# EAGLE design eiffel_mini Version2_2 (EAGLE 7.3.0)
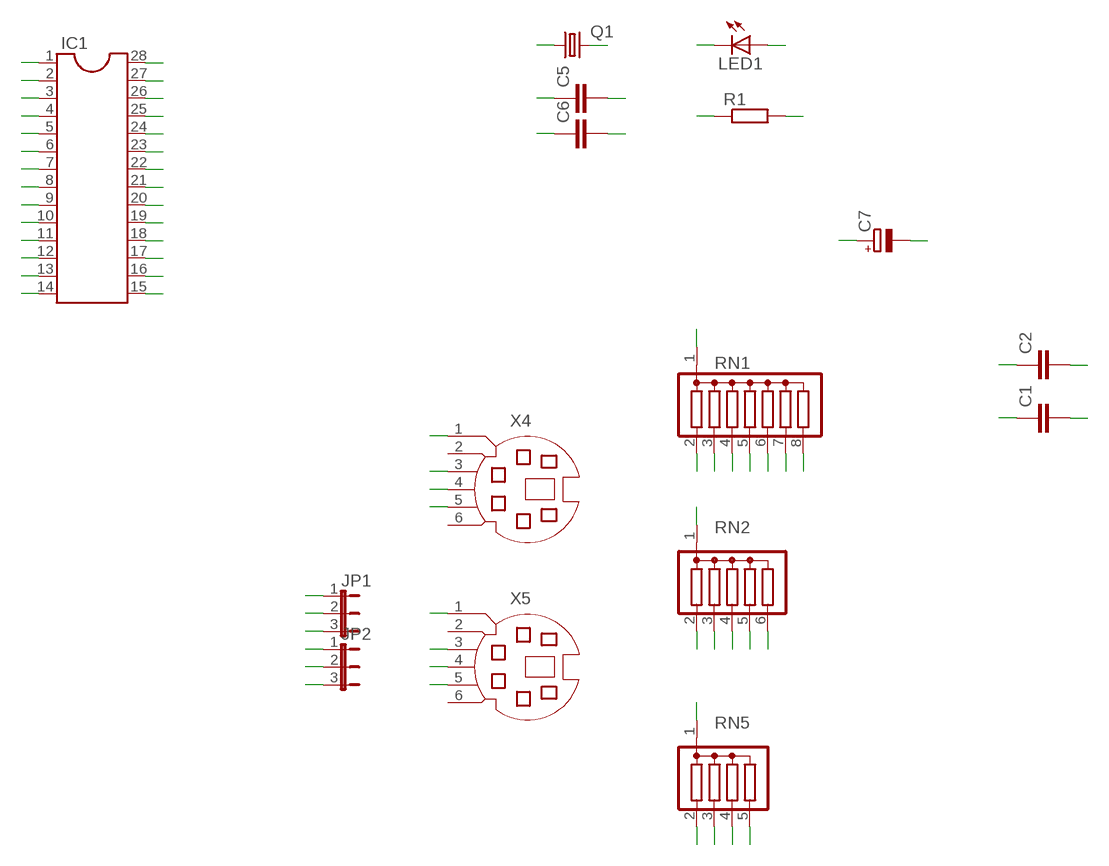
[diagram p0: schematic, sheet 1]

## Parts
C1  C-EU025-060X050  [C025-060X050]
C2  C-EU025-060X050  [C025-060X050]
C5  C-EU025-024X044  [C025-024X044]
C6  C-EU025-024X044  [C025-024X044]
C7  CPOL-EUE2,5-6E  [E2,5-6E]
IC1  DIL28-3  [DIL28-3]
JP1  JP2E  [JP2]
JP2  JP2E  [JP2]
LED1  LED3MM  [LED3MM]
Q1  CRYSTALHC49S  [HC49/S]
R1  R-EU_0204/7  [0204/7]
RN1  G07R  [SIL8]
RN2  G05R  [SIL6]
RN5  G04R  [SIL5]
X4  MD06S  [MDIN06S]
X5  MD06S  [MDIN06S]

## Nets
/MCLR: IC1.1 RN1.7
GND: C1.2 C2.2 C5.2 C6.2 C7.- IC1.8 IC1.19 JP2.2 JP2.3 LED1.K(C) X4.3 X5.3
LED: LED1.A R1.1
RA0: IC1.2 RN1.8
RA1: IC1.3 RN1.2
RA2: IC1.4 RN1.3
RA3: IC1.5 RN1.4
RA4: IC1.6 RN1.5
RA5: IC1.7 RN1.6
RB0: IC1.21 RN5.2 X5.1
RB1: IC1.22 RN5.3 X5.5
RB2: IC1.23 RN5.4 X4.1
RB3: IC1.24 RN5.5 X4.5
RB4: IC1.25
RB5: IC1.26
RB6: IC1.27
RB7: IC1.28
RC0: IC1.11 RN2.2
RC1: IC1.12 RN2.3
RC2: IC1.13 RN2.4
RC3: IC1.14 RN2.5
RC4: IC1.15 RN2.6
RC5: IC1.16
RC6: IC1.17 JP2.1
RC7: IC1.18 JP1.3
VCC: C1.1 C2.1 C7.+ IC1.20 JP1.1 JP1.2 R1.2 RN1.1 RN2.1 RN5.1 X4.4 X5.4
XI: C5.1 IC1.9 Q1.1
XO: C6.1 IC1.10 Q1.2
Unconnected: X4.2 X4.6 X5.2 X5.6

## Library data of the parts
C1 C2 C5 C6 = resistor:C-EU: CAPACITOR, European symbol
C7 = resistor:CPOL-EU: POLARIZED CAPACITOR, European symbol
IC1 = ic-package:DIL28: Dual In Line
JP1 JP2 = jumper:JP2E: JUMPER
LED1 = led:LED: LED OSRAM: - CHIPLED LG R971, LG N971, LY N971, LG Q971, LY Q971, LO R971, LY R971 LH N974, LH R974 LS Q976, LO Q976, LY Q976 LO Q996 - Hyper CHIPLED LW Q18S LB Q993, LB Q99A, LB R99A - SideLED LS A670, LO A670, LY A670, LG A670, LP A670 LB A673, LV A673, LT A673, LW A673 LH A674 LY A675 LS A676, LA A676, LO A676, LY A676, LW A676 LS A679, LY A679, LG A679 - Hyper Micro SIDELED® LS Y876, LA Y876, LO Y876, LY Y876 LT Y87S - SmartLED LW L88C, LW L88S LB L89C, LB L89S, LG L890 LS L89K, LO L89K, LY L89K LS L896, LA L896, LO L896, LY L896 - TOPLED LS T670, LO T670, LY T670, LG T670, LP T670 LSG T670, LSP T670, LSY T670, LOP T670, LYG T670 LG T671, LOG T671, LSG T671 LB T673, LV T673, LT T673, LW T673 LH T674 LS T676, LA T676, LO T676, LY T676, LB T676, LH T676, LSB T676, LW T676 LB T67C, LV T67C, LT T67C, LS T67K, LO T67K, LY T67K, LW E67C LS E67B, LA E67B, LO E67B, LY E67B, LB E67C, LV E67C, LT E67C LW T67C LS T679, LY T679, LG T679 LS T770, LO T770, LY T770, LG T770, LP T770 LB T773, LV T773, LT T773, LW T773 LH T774 LS E675, LA E675, LY E675, LS T675 LS T776, LA T776, LO T776, LY T776, LB T776 LHGB T686 LT T68C, LB T68C - Hyper Mini TOPLED® LB M676 - Mini TOPLED Santana® LG M470 LS M47K, LO M47K, LY M47K Source: http://www.osram.convergy.de LUXEON: - LUMILED® LXK2-PW12-R00, LXK2-PW12-S00, LXK2-PW14-U00, LXK2-PW14-V00 LXK2-PM12-R00, LXK2-PM12-S00, LXK2-PM14-U00 LXK2-PE12-Q00, LXK2-PE12-R00, LXK2-PE12-S00, LXK2-PE14-T00, LXK2-PE14-U00 LXK2-PB12-K00, LXK2-PB12-L00, LXK2-PB12-M00, LXK2-PB14-N00, LXK2-PB14-P00, LXK2-PB14-Q00 LXK2-PR12-L00, LXK2-PR12-M00, LXK2-PR14-Q00, LXK2-PR14-R00 LXK2-PD12-Q00, LXK2-PD12-R00, LXK2-PD12-S00 LXK2-PH12-R00, LXK2-PH12-S00 LXK2-PL12-P00, LXK2-PL12-Q00, LXK2-PL12-R00 Source: www.luxeon.com KINGBRIGHT: KA-3528ASYC Source: www.kingbright.com
Q1 = crystal:CRYSTAL: CRYSTAL; OC_FARNELL: 1667008; OC_NEWARK: unknown
R1 = resistor:R-EU_: RESISTOR, European symbol
RN1 = resistor-sil:G07R: SIL RESISTOR; OC_FARNELL: unknown; OC_NEWARK: unknown
RN2 = resistor-sil:G05R: SIL RESISTOR; OC_FARNELL: unknown; OC_NEWARK: unknown
RN5 = resistor-sil:G04R: SIL RESISTOR; OC_FARNELL: unknown; OC_NEWARK: unknown
X4 X5 = con-yamaichi:MD06S: YAMAICHI CONNECTOR; OC_FARNELL: unknown; OC_NEWARK: unknown

## Board
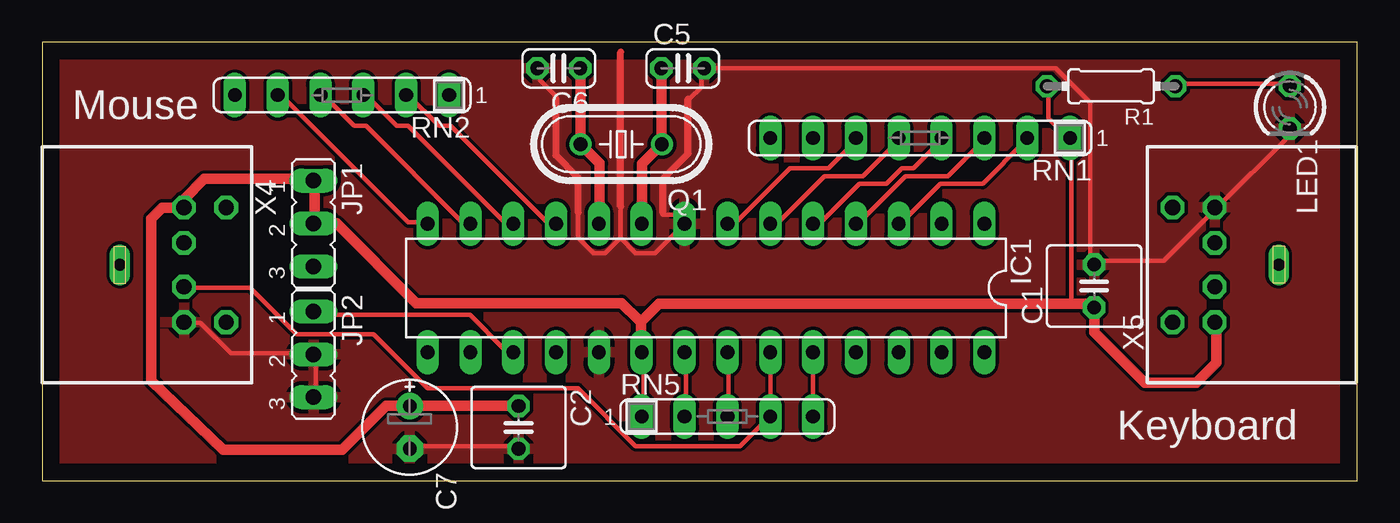
[diagram p1: board, top side]
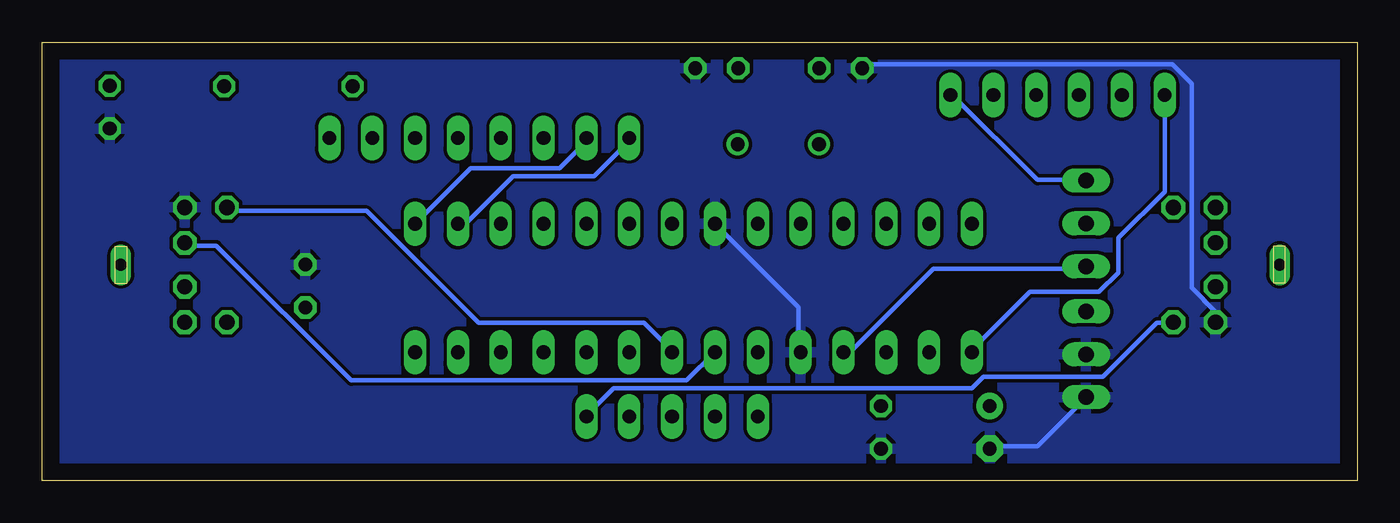
[diagram p2: board, bottom side, seen from below]

Size 78 x 26 mm. Coordinates in mm from the lower left corner, seen from the top.
Outline: 0,0 78,0 78,26 0,26 0,0
Copper layers (1*16): Top 0.035mm / dielectric 1.5mm / Bottom 0.035mm
Design rules "default": minimum track width 10mil, minimum drill 24mil, track to track 8mil, track to pad 8mil, pad to pad 8mil, via to via 8mil, smd to smd 8mil, copper to edge 40mil, drill to drill 8mil, minimum pad ring 10mil, minimum via ring 8mil, stop-mask expansion 4mil, vias tented up to drill 0mil, thermal gap 10mil

### Footprints (pad centres in the part's own frame; a part is rotated, then mirrored left to right if it is on the bottom)
C025-060X050 = drill 0.813 octagon: 1 -1.27,0; 2 1.27,0
C025-024X044 = drill 0.813 octagon: 1 -1.27,0; 2 1.27,0
E2,5-6E = drill 0.813 pad 1.575: + -1.27,0 | drill 0.813 pad 1.575 octagon: - 1.27,0
DIL28-3 = drill 0.813 long: 1 -16.51,-3.81; 2 -13.97,-3.81; 3 -11.43,-3.81; 4 -8.89,-3.81; 5 -6.35,-3.81; 6 -3.81,-3.81; 7 -1.27,-3.81; 8 1.27,-3.81; 9 3.81,-3.81; 10 6.35,-3.81; 11 8.89,-3.81; 12 11.43,-3.81; 13 13.97,-3.81; 14 16.51,-3.81; 15 16.51,3.81; 16 13.97,3.81; 17 11.43,3.81; 18 8.89,3.81; 19 6.35,3.81; 20 3.81,3.81; 21 1.27,3.81; 22 -1.27,3.81; 23 -3.81,3.81; 24 -6.35,3.81; 25 -8.89,3.81; 26 -11.43,3.81; 27 -13.97,3.81; 28 -16.51,3.81
JP2 = drill 0.914 long: 1 -2.54,0; 2 0,0; 3 2.54,0
LED3MM = drill 0.813 octagon: A -1.27,0; K 1.27,0
HC49/S = drill 0.813: 1 -2.413,0; 2 2.413,0
0204/7 = drill 0.813 octagon: 1 -3.81,0; 2 3.81,0
SIL8 = drill 0.813 long: 1 -8.89,0; 2 -6.35,0; 3 -3.81,0; 4 -1.27,0; 5 1.27,0; 6 3.81,0; 7 6.35,0; 8 8.89,0
SIL6 = drill 0.813 long: 1 -6.35,0; 2 -3.81,0; 3 -1.27,0; 4 1.27,0; 5 3.81,0; 6 6.35,0
SIL5 = drill 0.813 long: 1 -5.08,0; 2 -2.54,0; 3 0,0; 4 2.54,0; 5 5.08,0
MDIN06S = drill 0.9 octagon: 1 1.3,8.5; 2 -1.3,8.5; 3 3.4,8.5; 4 -3.4,8.5; 5 3.4,11; 6 -3.4,11 | drill 0.7 long: M 0,4.7

### Placement (x,y rotation side)
C1  62.39,11.54 90 top
C2  28.26,3.16 270 top
C5  37.99,24.45 0 top
C6  30.64,24.45 180 top
C7  21.8,3.17 270 top
IC1  39.37,11.43 180 top
JP1  16.08,15.25 270 top
JP2  16.09,7.49 270 top
LED1  74,22.15 270 top
Q1  34.34,19.95 180 top
R1  63.39,23.39 180 top
RN1  52.07,20.32 180 top
RN2  17.78,22.86 180 top
RN5  40.64,3.81 0 top
X4  -0.09,12.8 270 top
X5  78.04,12.8 90 top

### Tracks (layer width: path | path; a pad name or v marks a point on that pad's centre or on a via)
/MCLR
  Bottom 0.254: IC1.1 55.78,15.32 52.58,18.52 47.32,18.52 45.72,20.12 RN1.7
GND
  Top 0.254: C2.2 28.12,2.06 21.95,2.06 C7.- | X4.3 8.46,9.37 9.37,9.37 11.2,7.54 16,7.54 JP2.2 16.23,7.32 16.23,5.03 JP2.3 | LED1.K 73.84,20.8 73.84,20.34 69.72,16.23 X5.3 69.49,16 66.52,13.03 62.41,13.03 C1.2 62.18,13.03 62.18,22.4 60.12,24.46 39.32,24.46 C5.2 39.09,24.23 39.09,23.32 38.41,22.63 38.32,22.62 | C6.2 29.49,24.23 29.49,23.77 30.4,22.86 30.48,22.67 | 34.29,14.4 33.38,13.49 32.69,13.49 31.77,14.4 31.77,15.77 31.8,15.89 | 34.29,14.4 34.29,16.23 34.31,16.25 | 36.82,15.92 36.8,15.77 37.49,15.77 37.95,15.32 IC1.8 36.35,13.49 35.2,13.49 34.29,14.4
  Top 0.406: 31.8,15.89 31.8,17.97 30.48,19.29 30.48,22.67 | 36.82,15.92 36.82,17.9 38.32,19.39 38.32,22.62 | 34.31,16.25 34.31,25.41
  Bottom 0.254: C7.- 21.72,2.06 18.97,2.06 16.23,4.8 JP2.3 | IC1.8 33.15,10.29 33.15,7.77 IC1.19 | X4.3 8.46,9.6 8.46,10.06 9.83,11.43 9.83,23.55 10.97,24.69 29.03,24.69 29.26,24.46 C6.2
  pour Top: 0.42,25.55 77.64,25.55 77.64,0.47 0.42,0.47
  pour Bottom: 0.62,25.45 77.52,25.45 77.52,0.55 0.48,0.55 0.48,25.45
LED
  Top 0.254: R1.1 67.21,23.55 73.84,23.55 LED1.A
RA0
  Bottom 0.254: IC1.2 53.26,15.32 52.81,15.32 50.06,18.06 45.26,18.06 43.2,20.12 RN1.8
RA1
  Top 0.254: IC1.3 50.98,15.32 53.26,17.6 55.78,17.6 58.29,20.12 RN1.2
RA2
  Top 0.254: IC1.4 48.46,15.32 51.21,18.06 53.72,18.06 55.78,20.12 RN1.3
RA3
  Top 0.254: IC1.5 45.72,15.32 46.18,15.32 48.46,17.6 50.06,17.6 50.98,18.52 51.66,18.52 53.26,20.12 RN1.4
RA4
  Top 0.254: IC1.6 43.2,15.32 43.66,15.32 46.41,18.06 48.69,18.06 50.75,20.12 RN1.5
RA5
  Top 0.254: IC1.7 40.69,15.32 41.15,15.32 44.35,18.52 46.63,18.52 48.23,20.12 RN1.6
RB0
  Top 0.254: RN5.2 38.18,3.89 38.18,7.54 IC1.21
  Bottom 0.254: IC1.21 39.78,5.94 59.66,5.94 67.67,13.95 69.49,13.95 X5.1
RB1
  Top 0.254: RN5.3 40.69,3.89 40.69,7.54 IC1.22
  Bottom 0.254: X5.5 66.98,16 58.75,16 52.12,9.37 42.29,9.37 40.69,7.77 IC1.22
RB2
  Top 0.254: IC1.23 43.2,7.54 43.2,3.89 RN5.4 42.98,3.66 41.38,2.06 35.2,2.06 31.77,5.49 22.86,5.49 19.66,8.69 15.09,8.69 12.34,11.43 8.46,11.43 X4.1
RB3
  Top 0.254: IC1.24 RN5.5
  Bottom 0.254: X4.5 10.97,9.37 11.89,9.37 15.09,6.17 22.17,6.17 22.86,5.49 44.12,5.49 45.72,3.89 RN5.5
RC0
  Top 0.254: IC1.11 30.4,15.32 29.95,15.32 24.23,21.03 23.55,21.03 21.72,22.86 RN2.2
RC1
  Top 0.254: IC1.12 27.89,15.32 27.43,15.32 21.72,21.03 21.03,21.03 19.2,22.86 RN2.3
RC2
  Top 0.254: IC1.13 25.38,15.32 24.92,15.32 19.2,21.03 18.52,21.03 16.69,22.86 RN2.4
RC3
  Top 0.254: IC1.14 22.86,15.32 21.72,15.32 14.17,22.86 RN2.5
RC4
  Bottom 0.254: RN2.6 11.43,17.14 14.17,14.4 14.17,12.34 15.32,11.2 19.43,11.2 22.86,7.77 IC1.15
RC6
  Top 0.254: IC1.17 27.89,7.77 27.43,7.77 25.38,9.83 16.23,9.83 JP2.1
RC7
  Bottom 0.254: IC1.18 30.4,7.77 29.95,7.77 25.15,12.57 16.23,12.57 JP1.3
VCC
  Top 0.254: JP1.2 16.23,15.32 16.16,15.32 | C2.1 28.35,4.57 28.32,4.44 | 10.97,1.83 10.71,1.85 | 8.43,16.19 8.46,16.23 X4.4 8.46,16.46 8.45,16.73 | C7.+ 21.72,4.34 21.72,4.44 | JP1.1 16.23,17.83 16.06,17.89 | R1.2 59.66,23.32 59.66,21.49 60.81,20.34 RN1.1 61.04,20.12 61.04,10.48 | C1.1 62.41,10.29 C1.1 | RN5.1 35.66,3.89 35.66,7.32 IC1.20 35.66,8.46 35.53,8.46 | X5.4 69.72,9.37 69.63,9.34 | 35.36,9.53 35.43,9.6 35.53,9.42
  Top 0.61: 8.45,16.19 8.45,16.73 9.62,17.89 16.06,17.89 16.16,17.79 16.16,15.32 16.16,15.28 16.14,15.26 17.46,15.26 22.18,10.53 34.36,10.53 35.36,9.53 35.53,9.37 | 35.53,9.37 35.53,8.46 35.53,7.62 | 35.53,7.62 35.58,7.56 | 8.43,16.19 7.13,16.19 6.47,15.53 6.47,5.94 10.71,1.85 | 10.73,1.83 10.97,1.83 17.79,1.83 20.4,4.44 21.72,4.44 28.32,4.44 | 35.53,7.59 35.53,7.62 | 35.53,9.37 35.53,9.42 36.59,10.48 61.04,10.48 62.17,10.48 C1.1 62.4,10.26 62.4,8.81 65.39,5.81 68.44,5.81 69.63,7.01 69.63,9.34 69.55,9.42
  Bottom 0.254: RN2.1 24,22.86 18.97,17.83 16.23,17.83 JP1.1
XI
  Top 0.254: IC1.9 35.66,15.32 35.58,15.32 | 36.74,19.95 36.8,19.89 Q1.1 | C5.1 36.8,24.46 36.74,24.45
  Top 0.61: 35.58,15.21 35.58,15.32 35.58,18.79 36.74,19.95 36.74,24.45 36.77,24.47
XO
  Top 0.254: Q1.2 32,20.12 Q1.2 | 33.06,15.32 33.15,15.32 IC1.10 | C6.1 32,24.46 31.92,24.39
  Top 0.61: 33.06,15.23 33.06,15.32 33.06,18.81 Q1.2 31.92,24.39 31.87,24.45

### Text on the board
tNames: Mouse | Keyboard